# Altium schematic sheet pca10143_sheet7_wifi.SchDoc: PCA10143 - Wifi Device
size A3; Organization: Nordic Semiconductor; DocumentNumber: 6; Revision: 0.7.2; SheetNumber: 7; SheetTotal: 7; CompanyName: Nordic Semiconductor
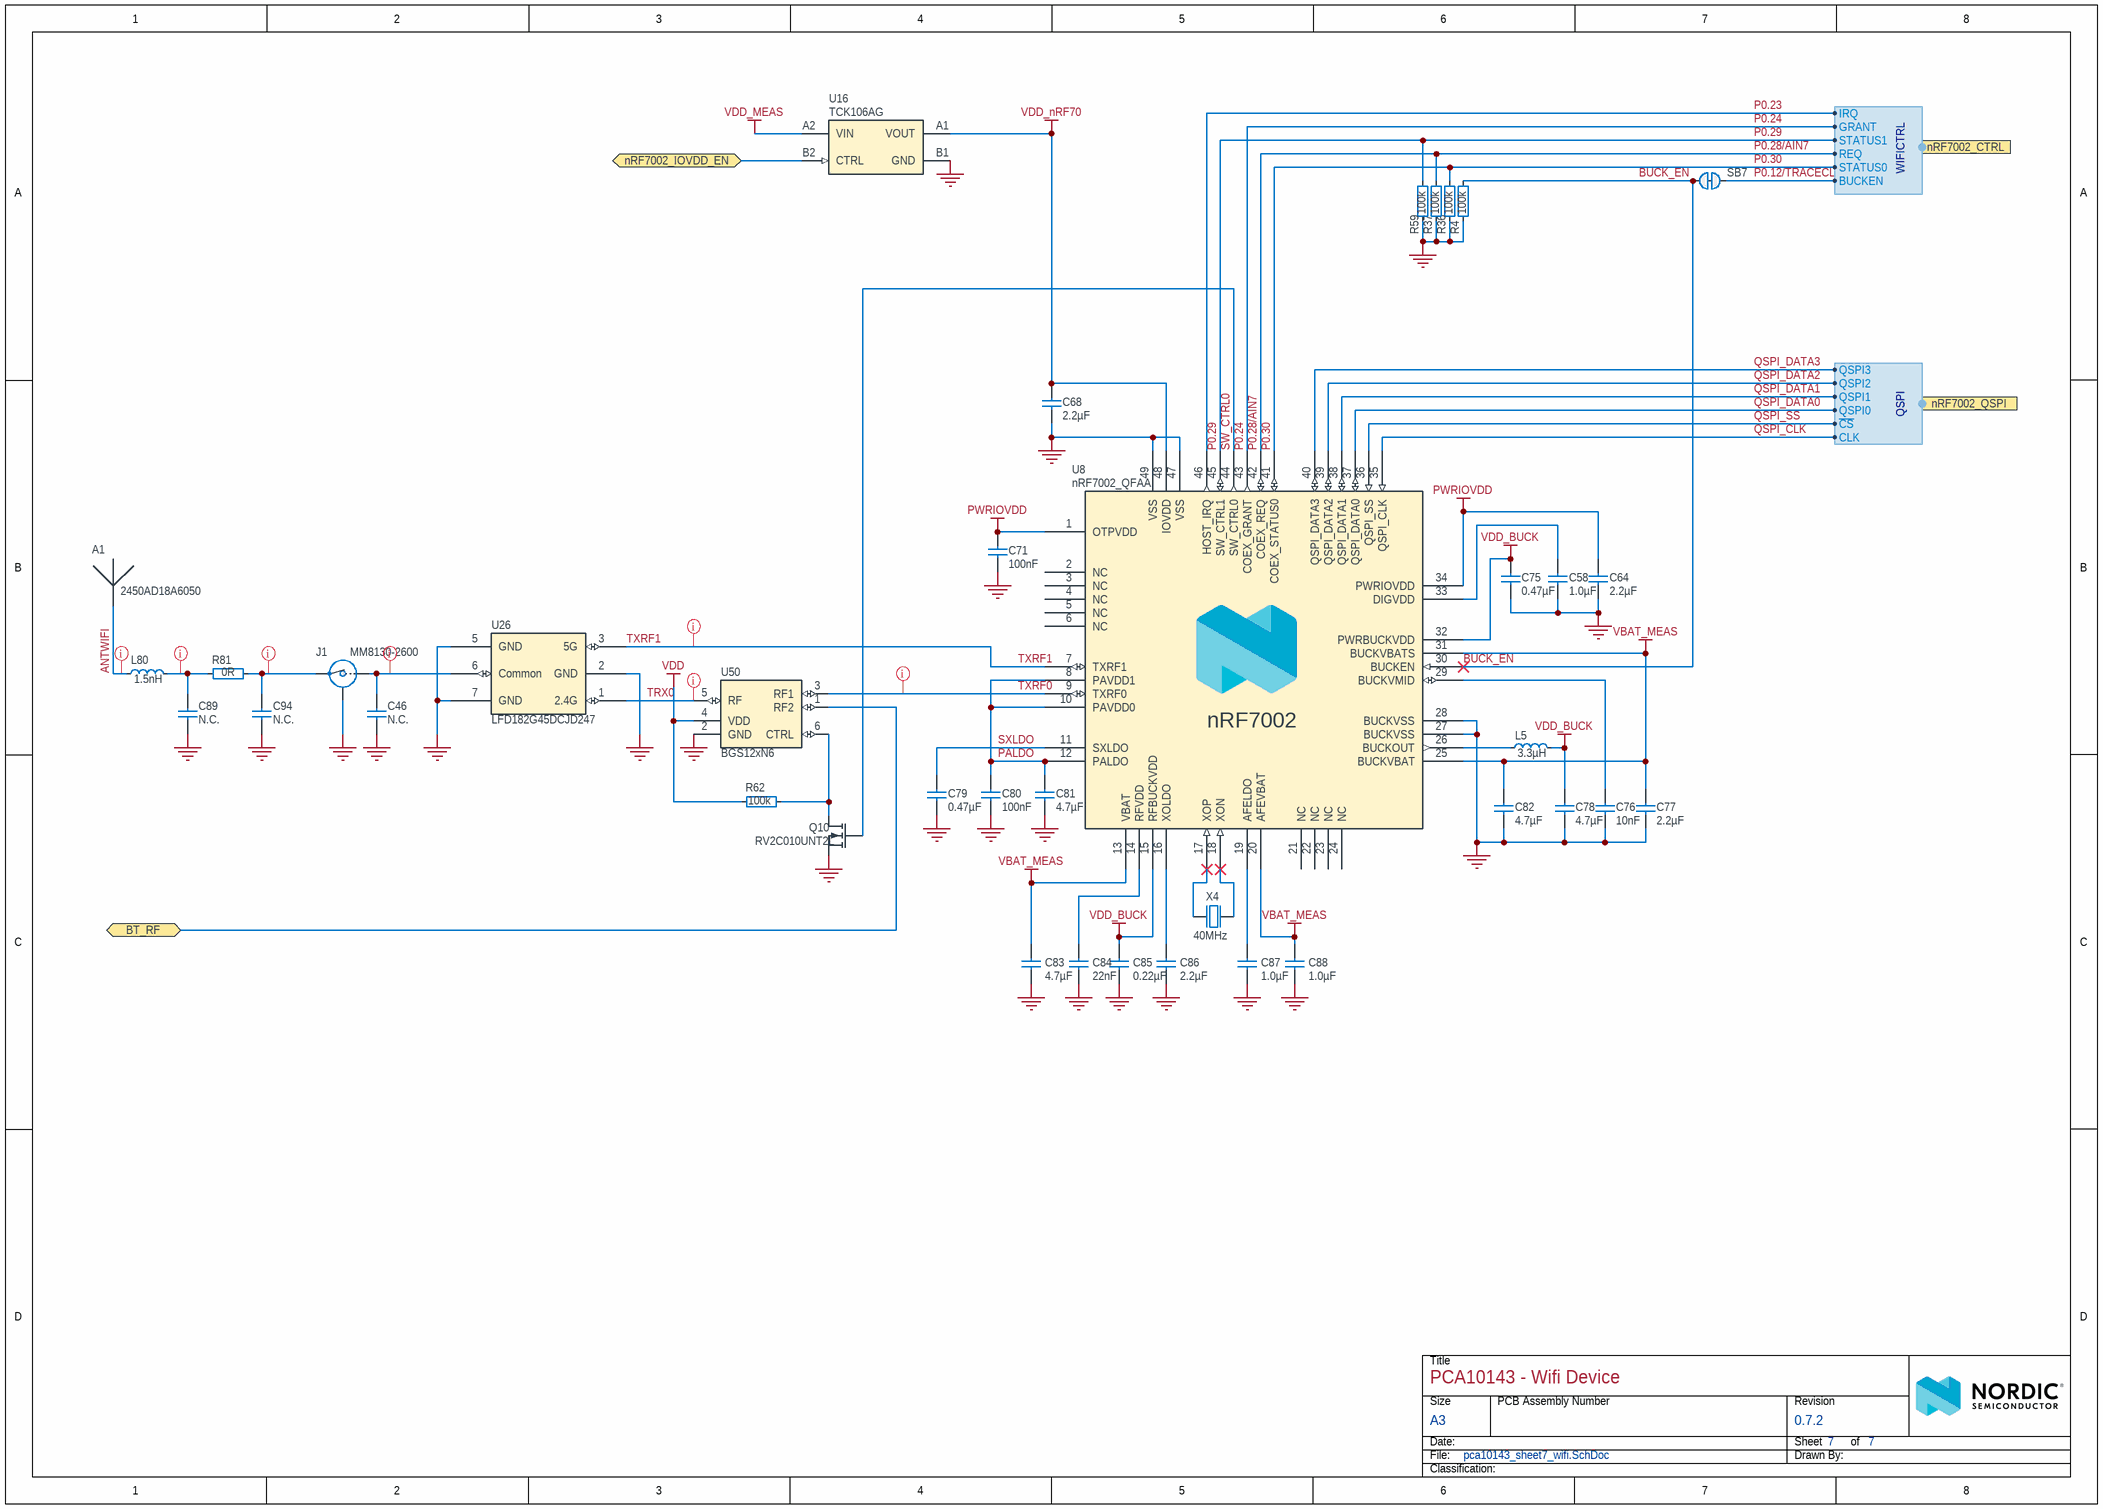
[diagram p0: pca10143_sheet7_wifi.SchDoc]

## Parts
A1  2450AD18A6050  [2450AD18A6050]
C46  N.C.  [CAPC0603X03L_C_NC]
C58  1.0µF  [CAPC1005X04L]
C64  2.2µF  [CAPC1005X04L]
C68  2.2µF  [CAPC1608X06L]
C71  100nF  [CAPC0603X03L_C]
C75  0.47µF  [CAPC0603X03L_C]
C76  10nF  [CAPC0603X03L_C]
C77  2.2µF  [CAPC1608X06L]
C78  4.7µF  [CAPC1608X06L]
C79  0.47µF  [CAPC0603X03L_C]
C80  100nF  [CAPC0603X03L_C]
C81  4.7µF  [CAPC1608X06L]
C82  4.7µF  [CAPC1608X06L]
C83  4.7µF  [CAPC1608X06L]
C84  22nF  [CAPC0603X03L_C]
C85  0.22µF  [CAPC0603X03L_C]
C86  2.2µF  [CAPC0603X03L_C]
C87  1.0µF  [CAPC1005X04L]
C88  1.0µF  [CAPC1005X04L]
C89  N.C.  [CAPC0603X03L_C_NC]
C94  N.C.  [CAPC0603X03L_C_NC]
J1  MM8130-2600  [COAXIAL-SWF]
L5  3.3µH  [INDC2520X10N]
L80  1.5nH  [INDC0603X03L_C]
Q10  RV2C010UNT2L  [DFN65P100X40-3L]
R4  100k  [RESC0603X03L_C]
R36  100k  [RESC0603X03L_C]
R37  100k  [RESC0603X03L_C]
R59  100k  [RESC0603X03L_C]
R62  100k  [RESC0603X03L_C]
R81  0R  [RESC0603X03L_C]
SB7  Solderbridge  [Solderbridge_Shorted]  (value not drawn)  (net tie, no BOM)
U8  nRF7002_QFAA  [QFN40P600X600X60-48N]
U16  TCK106AG  [BGA4C40P2X2_76X76X62]
U26  value LFD182G45DCJD247  [CAF-50P160X80-6N]  (hidden comment: LFD_Diplexer)
U50  BGS12xN6  [TSNP-6-8]
X4  40MHz  [BT-XTAL_1612]

## Ports
BT_RF (bidir), nRF7002_CTRL (harness WIFICTRL), nRF7002_IOVDD_EN (bidir), nRF7002_QSPI (harness QSPI)

## Harnesses
QSPI: ~{CS}, QSPI0, CLK, QSPI1, QSPI2, QSPI3
WIFICTRL: REQ, STATUS0, GRANT, IRQ, BUCKEN, STATUS1

## Nets
GND: C46.2 C58.2 C64.1 C68.2 C71.2 C75.1 C76.2 C77.2 C78.1 C79.1 C80.2 C81.1 C82.1 C83.1 C84.1 C85.1 C86.1 C87.1 C88.1 C89.2 C94.2 J1.2(Shield) Q10.2(S) R4.1 R36.2 R37.2 R59.2 U8.27(BUCKVSS) U8.28(BUCKVSS) U8.47(VSS) U8.49(VSS) U16.B1(GND) U26.2(GND) U26.5(GND) U26.7(GND) U50.2(GND) X4.2(GND) X4.4(GND)
PWRIOVDD: C64.2 C71.1 U8.1(OTPVDD) U8.34(PWRIOVDD)
VBAT_MEAS: C77.1 C82.2 C83.2 C88.2 U8.13(VBAT) U8.20(AFEVBAT) U8.25(BUCKVBAT) U8.31(BUCKVBATS)
VDD: R62.1 U50.4(VDD)
VDD_BUCK: C75.2 C78.2 C85.2 L5.2 U8.15(RFBUCKVDD) U8.32(PWRBUCKVDD)
VDD_MEAS: U16.A2(VIN)
VDD_nRF70: C68.1 U8.48(IOVDD) U16.A1(VOUT)
ANTWIFI: A1.1 L80.1
BT_RF: U50.1(RF2) ; port BT_RF
BUCK_EN: R4.2 SB7.2 U8.30(BUCKEN)
nRF7002_IOVDD_EN: U16.B2(CTRL) ; port nRF7002_IOVDD_EN
P0.12/TRACECLK: SB7.1 ; port nRF7002_CTRL.BUCKEN
P0.23: U8.46(HOST_IRQ) ; port nRF7002_CTRL.IRQ
P0.24: U8.43(COEX_GRANT) ; port nRF7002_CTRL.GRANT
P0.28/AIN7: R37.1 U8.42(COEX_REQ) ; port nRF7002_CTRL.REQ
P0.29: R59.1 U8.45(SW_CTRL1) ; port nRF7002_CTRL.STATUS1
P0.30: R36.1 U8.41(COEX_STATUS0) ; port nRF7002_CTRL.STATUS0
PALDO: C80.1 C81.2 U8.8(PAVDD1) U8.10(PAVDD0) U8.12(PALDO)
QSPI_CLK: U8.35(QSPI_CLK) ; port nRF7002_QSPI.CLK
QSPI_DATA0: U8.37(QSPI_DATA0) ; port nRF7002_QSPI.QSPI0
QSPI_DATA1: U8.38(QSPI_DATA1) ; port nRF7002_QSPI.QSPI1
QSPI_DATA2: U8.39(QSPI_DATA2) ; port nRF7002_QSPI.QSPI2
QSPI_DATA3: U8.40(QSPI_DATA3) ; port nRF7002_QSPI.QSPI3
QSPI_SS: U8.36(QSPI_SS) ; port nRF7002_QSPI.~{CS}
SW_CTRL0: Q10.1(G) U8.44(SW_CTRL0)
SXLDO: C79.2 U8.11(SXLDO)
TRX0: U26.1(2.4G) U50.5(RF)
TXRF0: U8.9(TXRF0) U50.3(RF1)
TXRF1: U8.7(TXRF1) U26.3(5G)
NetC46_1: C46.1 J1.1(IN) U26.6(Common)
NetC58_1: C58.1 U8.33(DIGVDD)
NetC76_1: C76.1 U8.29(BUCKVMID)
NetC84_2: C84.2 U8.14(RFVDD)
NetC86_2: C86.2 U8.16(XOLDO)
NetC87_2: C87.2 U8.19(AFELDO)
NetC89_1: C89.1 L80.2 R81.1
NetC94_1: C94.1 J1.3(OUT) R81.2
NetL5_1: L5.1 U8.26(BUCKOUT)
NetQ10_3: Q10.3(D) R62.2 U50.6(CTRL)
NetU8_17: U8.17(XOP) X4.1(inp)
NetU8_18: U8.18(XON) X4.3(out)

Not connected (* = marked no-connect by the designer): U8 2(NC) 3(NC) 4(NC) 5(NC) 6(NC) 21(NC) 22(NC) 23(NC) 24(NC); U50 8(NC)

## Layout directives
net class RF50Ohm: ANTWIFI, NetC46_1, NetC89_1, NetC94_1, TRX0, TXRF0, TXRF1

## Notes on the sheet
- Title
- Size
- Date:
- File:
- A3
- PCB Assembly Number
- Sheet         of
- Drawn By:
- Revision
- Classification:

## Library data of the parts
A1 = 2450AD18A6050: 2.4, 5, and 6GHz BT/WiFi6E Mini Antenna, Single-feed, Tri-band, Corner Mount; Manufacturer: Johanson Technology; Part number NEMS: 100700074; Pad Count: 2; Note: N.A.; Component Status: Active; Part Number: 2450AD18A6050; PartId: 100700074; Component Class: Antennas; Author: hany; Manufacturer Part Number: 2450AD18A6050; ComponentLink1URL: https://www.johansontechnology.com/datasheets/2450AD18A6050/2450AD18A6050.pdf; ComponentLink1Description: Datasheet; ComponentLink2URL: N.A.; ComponentLink2Description: Supplier link; HelpURL: N.A.; Footprint Doc: 2450AD18A6050; LatestRevisionDate: 2022-01-21; Published: 2022-01-21; Value: 2450AD18A6050; Supplier 1: Digi-Key; Supplier Part Number 1: 712-2450AD18A6050ETR-ND; Supplier 2: Mouser; Supplier Part Number 2: 609-2450AD18A6050; Artikkelnr Noca: N.A.; Part number IPS: N.A.; Part number Norautron: N.A.
C46 C89 C94 = C0201-N.C.: Not mounted; Manufacturer: N.A.; Part number NEMS: 100200001; Note: Chip Cap; Assembly: Not mounted; Pad Count: 2; Component Status: Active; Part Number: C0201-N.C.; Manufacturer Part Number: N.A.; LatestRevisionDate: 2014-11-13; Published: 2014-11-13; Value: N.C.; Artikkelnr Noca: N.A.; Footprint Doc: 0201; Part number IPS: N.A.; ComponentLink1URL: N.A.; ComponentLink1Description: Datasheet; ComponentLink2URL: N.A.; ComponentLink2Description: Supplier link; HelpURL: N.A.; Supplier 1: N.A.; Supplier Part Number 1: N.A.; Supplier 2: N.A.; Supplier Part Number 2: N.A.; Component Class: Capacitors; PartId: 100200001; Author: rsk; Part number Norautron: N.A.
C58 = C0402-1µ0-16V-X6S-GRM155C81C105KE11: Capacitor, Ceramic, 1.0µF 16V X6S 0402,±10%; Manufacturer: Murata; Part number NEMS: 100200493; Pad Count: 2; Artikkelnr Noca: N.A.; Component Status: Active; Part Number: C0402-1µ0-16V-X6S-GRM155C81C105KE11; Component Class: Capacitors; Author: prbu; Manufacturer Part Number: GRM155C81C105KE11; ComponentLink1URL: https://www.murata.com/en-sg/products/productdetail?partno=GRM155C81C105KE11%23; ComponentLink1Description: Datasheet; ComponentLink2URL: https://www.mouser.com/ProductDetail/Murata-Electronics/GRM155C81C105KE11J?qs=qSfuJ%252Bfl%2Fd5QDM5fFpbyoA%3D%3D; ComponentLink2Description: Supplier link; HelpURL: N.A.; Footprint Doc: 0402; LatestRevisionDate: 2021-12-09; Published: 2021-12-09; Value: 1.0µF; Note: 16V; Supplier 1: Mouser; Supplier Part Number 1: 81-GRM155C81C105KE1J; Supplier 2: Digi-Key; Supplier Part Number 2: 490-GRM155C81C105KE11JCT-ND; Part number IPS: N.A.; Part number Norautron: N.A.; PartId: 100200493
C64 = C0402-2µ2-25V-X5R-GRM155R61E225KE11: Capacitor, Ceramic, 2.2µF 25V X5R 0201,±10%; Manufacturer: Murata; Part number NEMS: 100200492; Pad Count: 2; Artikkelnr Noca: N.A.; Component Status: Active; Part Number: C0402-2µ2-25V-X5R-GRM155R61E225KE11; Component Class: Capacitors; Author: prbu; Manufacturer Part Number: GRM155R61E225KE11; ComponentLink1URL: https://www.murata.com/en-sg/products/productdetail?partno=GRM155R61E225KE11%23; ComponentLink1Description: Datasheet; ComponentLink2URL: https://www.mouser.com/ProductDetail/Murata-Electronics/GRM155R61E225KE11D?qs=eeBpzGFlv%252B8X58bIUndZvA%3D%3D; ComponentLink2Description: Supplier link; HelpURL: N.A.; Footprint Doc: 0402; LatestRevisionDate: 2021-12-09; Published: 2021-12-09; Value: 2.2µF; Note: 25V; Supplier 1: Mouser; Supplier Part Number 1: 81-GRM155R61E225KE1D; Supplier 2: Digi-Key; Supplier Part Number 2: 490-12703-1-ND; Part number IPS: N.A.; Part number Norautron: N.A.; PartId: 100200492
C68 C77 = C0603-2µ2-16V-X7S-GRM188C71C225KE11: Capacitor, Ceramic, 2.2µF 16V X7S 0603,±10%; Manufacturer: Murata; Part number NEMS: 100200490; Pad Count: 2; Artikkelnr Noca: N.A.; Component Status: Active; Part Number: C0603-2µ2-16V-X7S-GRM188C71C225KE11; Component Class: Capacitors; Author: prbu; Manufacturer Part Number: GRM188C71C225KE11; ComponentLink1URL: https://www.murata.com/en-sg/products/productdetail?partno=GRM188C71C225KE11%23; ComponentLink1Description: Datasheet; ComponentLink2URL: https://www.mouser.com/ProductDetail/Murata-Electronics/GRM188C71C225KE11D?qs=ipkqEa07%2FjwigLKmkO4MzA%3D%3D; ComponentLink2Description: Supplier link; HelpURL: N.A.; Footprint Doc: 0603; LatestRevisionDate: 2021-12-09; Published: 2021-12-09; Value: 2.2µF; Note: 16V; Supplier 1: Mouser; Supplier Part Number 1: 81-GRM188C71C225KE1D; Supplier 2: Digi-Key; Supplier Part Number 2: 490-12731-1-ND; Part number IPS: N.A.; Part number Norautron: N.A.; PartId: 100200490
C71 C80 = C0201-100n-16V-X7S-GRM033C71C104KE14: Capacitor, Ceramic, 100nF 16V X7S 0201,±10%; Manufacturer: Murata; Part number NEMS: 100200494; Pad Count: 2; Artikkelnr Noca: N.A.; Component Status: Active; Part Number: C0201-100n-16V-X7S-GRM033C71C104KE14; Component Class: Capacitors; Author: prbu; Manufacturer Part Number: GRM033C71C104KE14; ComponentLink1URL: https://www.murata.com/en-sg/products/productdetail?partno=GRM033C71C104KE14%23; ComponentLink1Description: Datasheet; ComponentLink2URL: https://www.mouser.com/ProductDetail/Murata-Electronics/GRM033C71C104KE14D?qs=P%2FC4Eoq9CDzkjc0H6wJP9A%3D%3D; ComponentLink2Description: Supplier link; HelpURL: N.A.; Footprint Doc: 0201; LatestRevisionDate: 2021-12-09; Published: 2021-12-09; Value: 100nF; Note: 16V; Supplier 1: Mouser; Supplier Part Number 1: 81-GRM33C71C104KE14D; Supplier 2: Digi-Key; Supplier Part Number 2: 490-10387-1-ND; Part number IPS: N.A.; Part number Norautron: N.A.; PartId: 100200494
C75 C79 = C0201-470n-6.3V-X5R-GRM033R60J474KE90: Capacitor, Ceramic, 0.47µF 6.3V X5R 0201,±10%; Manufacturer: Murata; Part number NEMS: 100200488; Pad Count: 2; Artikkelnr Noca: N.A.; Component Status: Active; Part Number: C0201-470n-6.3V-X5R-GRM033R60J474KE90; Component Class: Capacitors; Author: prbu; Manufacturer Part Number: GRM033R60J474KE90; ComponentLink1URL: https://www.murata.com/en-sg/products/productdetail?partno=GRM033R60J474KE90%23; ComponentLink1Description: Datasheet; ComponentLink2URL: https://www.mouser.com/ProductDetail/Murata-Electronics/GRM033R60J474KE90D?qs=sGAEpiMZZMsKMBVpGK0sItoTn08PM719efpAd7qZWQ4%3D; ComponentLink2Description: Supplier link; HelpURL: N.A.; Footprint Doc: 0201; LatestRevisionDate: 2021-12-09; Published: 2021-12-09; Value: 0.47µF; Note: 6.3V; Supplier 1: Digi-Key; Supplier Part Number 1: 490-10410-1-ND; Supplier 2: Mouser; Supplier Part Number 2: 81-GRM33R60J474KE90D; Part number IPS: N.A.; Part number Norautron: N.A.; PartId: 100200488
C76 = C0201-10n-16V-X7R-GRM033R71C103KE14: Capacitor, Ceramic, 10nF 16V X7R 0201,±10%; Manufacturer: Murata; Part number NEMS: 100200491; Pad Count: 2; Artikkelnr Noca: N.A.; Component Status: Active; Part Number: C0201-10n-16V-X7R-GRM033R71C103KE14; Component Class: Capacitors; Author: prbu; Manufacturer Part Number: GRM033R71C103KE14; ComponentLink1URL: https://www.murata.com/en-sg/products/productdetail?partno=GRM033R71C103KE14%23; ComponentLink1Description: Datasheet; ComponentLink2URL: https://www.mouser.com/ProductDetail/Murata-Electronics/GRM033R71C103KE14D?qs=QzBtWTOodeUmwPFZnw4Ogg%3D%3D; ComponentLink2Description: Supplier link; HelpURL: N.A.; Footprint Doc: 0201; LatestRevisionDate: 2021-12-09; Published: 2021-12-09; Value: 10nF; Note: 16V; Supplier 1: Digi-Key; Supplier Part Number 1: 490-14453-1-ND; Supplier 2: Mouser; Supplier Part Number 2: 81-GRM033R71C103KE4D; Part number IPS: N.A.; Part number Norautron: N.A.; PartId: 100200491
C78 C81-C83 = C0603-4µ7-25V-X6S-GRM188C81E475KE11: Capacitor, Ceramic, 4.7µF 25V X6S 0603,±10%; Manufacturer: Murata; Part number NEMS: 100200486; Pad Count: 2; Artikkelnr Noca: N.A.; Component Status: Active; Part Number: C0603-4µ7-25V-X6S-GRM188C81E475KE11; Component Class: Capacitors; Author: prbu; Manufacturer Part Number: GRM188C81E475KE11; ComponentLink1URL: https://www.murata.com/en-global/products/productdetail?partno=GRM188C81E475KE11%23; ComponentLink1Description: Datasheet; ComponentLink2URL: https://www.digikey.com/en/products/detail/murata-electronics/GRM188C81E475KE11D/3900424; ComponentLink2Description: Supplier link; HelpURL: N.A.; Footprint Doc: 0603; LatestRevisionDate: 2021-12-09; Published: 2021-12-09; Value: 4.7µF; Note: 25V; Supplier 1: Digi-Key; Supplier Part Number 1: 490-7199-1-ND; Supplier 2: Mouser; Supplier Part Number 2: 81-GRM188C81E475KE1D; Part number IPS: N.A.; Part number Norautron: N.A.; PartId: 100200486
C84 = C0201-22n-10V-X5R-GRM033R61A223KE84: Capacitor, Ceramic, 22nF 10V X5R 0201,±10%; Manufacturer: Murata; Part number NEMS: 100200495; Pad Count: 2; Artikkelnr Noca: N.A.; Component Status: Active; Part Number: C0201-22n-10V-X5R-GRM033R61A223KE84; Component Class: Capacitors; Author: prbu; Manufacturer Part Number: GRM033R61A223KE84; ComponentLink1URL: https://www.murata.com/en-sg/products/productdetail?partno=GRM033R61A223KE84%23; ComponentLink1Description: Datasheet; ComponentLink2URL: https://www.mouser.com/ProductDetail/Murata-Electronics/GRM033R61A223KE84E?qs=BZBei1rCqCCPqziwOnRusw%3D%3D; ComponentLink2Description: Supplier link; HelpURL: N.A.; Footprint Doc: 0201; LatestRevisionDate: 2021-12-09; Published: 2021-12-09; Value: 22nF; Note: 10V; Supplier 1: Mouser; Supplier Part Number 1: 81-GRM033R61A223KE4E; Supplier 2: Digi-Key; Supplier Part Number 2: 490-13334-1-ND; Part number IPS: N.A.; Part number Norautron: N.A.; PartId: 100200495
C85 = C0201-220n-10V-X5R-GRM033R61A224KE90: Capacitor, Ceramic, 0.22µF 10V X5R 0201, ±10%; Manufacturer: Murata; Part number NEMS: 100200487; Pad Count: 2; Artikkelnr Noca: N.A.; Component Status: Active; Part Number: C0201-220n-10V-X5R-GRM033R61A224KE90; Component Class: Capacitors; Author: prbu; Manufacturer Part Number: GRM033R61A224KE90; ComponentLink1URL: https://www.murata.com/en-sg/products/productdetail?partno=GRM033R61A224KE90%23; ComponentLink1Description: Datasheet; ComponentLink2URL: https://www.mouser.com/ProductDetail/Murata-Electronics/GRM033R61A224KE90D?qs=sGAEpiMZZMtXHE36kCvv3zgoTDayw1zTTbet6g8ub%252Bg%3D; ComponentLink2Description: Supplier link; HelpURL: N.A.; Footprint Doc: 0201; LatestRevisionDate: 2021-12-09; Published: 2021-12-09; Value: 0.22µF; Note: 10V; Supplier 1: Mouser; Supplier Part Number 1: 81-GRM33R61A224KE90D; Supplier 2: Mouser; Supplier Part Number 2: 81-GRM033R61A224KE0J; Part number IPS: N.A.; Part number Norautron: N.A.; PartId: 100200487
C86 = C0201-2µ2-10V-X5R-GRM033R61A225KE47: Capacitor, Ceramic, 2.2µF 10V X5R 0201,±10%; Manufacturer: Murata; Part number NEMS: 100200496; Pad Count: 2; Artikkelnr Noca: N.A.; Component Status: Active; Part Number: C0201-2µ2-10V-X5R-GRM033R61A225KE47; Component Class: Capacitors; Author: prbu; Manufacturer Part Number: GRM033R61A225KE47; ComponentLink1URL: https://www.murata.com/en-sg/products/productdetail?partno=GRM033R61A225KE47%23; ComponentLink1Description: Datasheet; ComponentLink2URL: https://www.mouser.com/ProductDetail/Murata-Electronics/GRM033R61A225KE47D?qs=I53XXhTNm8tqgHaFsI1bug%3D%3D; ComponentLink2Description: Supplier link; HelpURL: N.A.; Footprint Doc: 0201; LatestRevisionDate: 2021-12-09; Published: 2021-12-09; Value: 2.2µF; Note: 10V; Supplier 1: Mouser; Supplier Part Number 1: 81-GRM033R61A225KE7D; Supplier 2: Digi-Key; Supplier Part Number 2: 490-GRM033R61A225KE47JCT-ND; Part number IPS: N.A.; Part number Norautron: N.A.; PartId: 100200496
C87 = C0402-1µ0-10V-X7S-GRM155C71A105KE11: Capacitor, Ceramic, 1.0µF 10V X7S 0402,±10%; Manufacturer: Murata; Part number NEMS: 100200497; Pad Count: 2; Artikkelnr Noca: N.A.; Component Status: Active; Part Number: C0402-1µ0-10V-X7S-GRM155C71A105KE11; Component Class: Capacitors; Author: prbu; Manufacturer Part Number: GRM155C71A105KE11; ComponentLink1URL: https://www.murata.com/en-sg/products/productdetail?partno=GRM155C71A105KE11%23; ComponentLink1Description: Datasheet; ComponentLink2URL: https://www.digikey.com/en/products/detail/murata-electronics/GRM155C71A105KE11D/6606086; ComponentLink2Description: Supplier link; HelpURL: N.A.; Footprint Doc: 0402; LatestRevisionDate: 2021-12-09; Published: 2021-12-09; Value: 1.0µF; Note: 10V; Supplier 1: Mouser; Supplier Part Number 1: 81-GRM155C71A105KE1J; Supplier 2: Digi-Key; Supplier Part Number 2: 490-14457-1-ND; Part number IPS: N.A.; Part number Norautron: N.A.; PartId: 100200497
C88 = C0402-1µ0-35V-X5R-GRM155R6YA105KE11: Capacitor, Ceramic, 1.0µF 35V X5R 0402,±10%; Manufacturer: Murata; Part number NEMS: 100200489; Pad Count: 2; Artikkelnr Noca: N.A.; Component Status: Active; Part Number: C0402-1µ0-35V-X5R-GRM155R6YA105KE11; Component Class: Capacitors; Author: prbu; Manufacturer Part Number: GRM155R6YA105KE11; ComponentLink1URL: https://www.murata.com/en-sg/products/productdetail?partno=GRM155R6YA105KE11%23; ComponentLink1Description: Datasheet; ComponentLink2URL: https://www.digikey.com/en/products/detail/murata-electronics/GRM155R6YA105KE11D/4905162; ComponentLink2Description: Supplier link; HelpURL: N.A.; Footprint Doc: 0402; LatestRevisionDate: 2021-12-09; Published: 2021-12-09; Value: 1.0µF; Note: 35V; Supplier 1: Mouser; Supplier Part Number 1: 81-GRM155R6YA105KE1D; Supplier 2: Digi-Key; Supplier Part Number 2: 490-10019-1-ND; Part number IPS: N.A.; Part number Norautron: N.A.; PartId: 100200489
J1 = MM8130-2600: Coaxial Connector with Switch; Manufacturer: Murata; Part number IPS: 00000009955; Part number Norautron: 26030338; Part number NEMS: 100500400; Note: N.A.; Artikkelnr Noca: 55029011; Pad Count: 3; Component Status: Active; Part Number: MM8130-2600; Manufacturer Part Number: MM8130-2600; LatestRevisionDate: 2014-04-24; Published: 2014-04-24; Value: MM8130-2600; Footprint Doc: COAXIAL-SWF; ComponentLink1URL: N.A.; ComponentLink1Description: Datasheet; ComponentLink2URL: N.A.; ComponentLink2Description: Supplier link; HelpURL: http://www.murata.com/products/catalog/pdf/o33e.pdf; Supplier 1: Digi-Key; Supplier Part Number 1: 490-4981-1-ND; Supplier 2: Mouser; Supplier Part Number 2: 81-MM8130-2600RA2; Component Class: Connectors; PartId: 100500400; Author: rsk
L5 = L1008-3µ3-LQM2HPN3R3MGCL: Inductor, 1A, ±20%, 200mOhm; Manufacturer: Murata; Part number NEMS: 100300406; Pad Count: 2; Note: -55°C ~ 125°C; Artikkelnr Noca: N.A.; Component Status: Active; Part Number: L1008-3µ3-LQM2HPN3R3MGCL; PartId: 100300406; Component Class: Inductors; Author: prbu; Manufacturer Part Number: LQM2HPN3R3MGCL; ComponentLink1URL: https://www.murata.com/en-sg/products/productdetail?partno=LQM2HPN3R3MGC%23; ComponentLink1Description: Datasheet; ComponentLink2URL: https://www.digikey.com/en/products/detail/murata-electronics/LQM2HPN3R3MGCL/4359129?s=N4IgTCBcDaIDIEUCyYASAFAcgZgEraQHEBhOEAXQF8g; ComponentLink2Description: Supplier link; HelpURL: https://www.murata.com/en-sg/products/productdetail?partno=LQM2HPN3R3MGC%23; Footprint Doc: 1008; LatestRevisionDate: 2022-01-20; Published: 2022-01-20; Value: 3.3µH; Supplier 1: Digi-Key; Supplier Part Number 1: 490-12070-1-ND; Supplier 2: N.A.; Supplier Part Number 2: N.A.; Part number IPS: N.A.; Part number Norautron: N.A.
L80 = L0201-1n5-HQ-Murata: Inductor, 1000mA, ±0.1ｎH, 50mOhm; Manufacturer: Murata; Manufacturer Part Number: LQP03HQ1N5B02; Part number NEMS: 100300202; Pad Count: 2; Note: -55°C ~ 125°C; Artikkelnr Noca: N.A.; Component Status: Active; Part Number: L0201-1n5-HQ-Murata; PartId: 100300202; Component Class: Inductors; Author: rsk; ComponentLink1URL: https://search.murata.co.jp/Ceramy/image/img/P02/JELF243C-0021.pdf; ComponentLink1Description: Datasheet; ComponentLink2URL: N.A.; ComponentLink2Description: Supplier link; HelpURL: https://psearch.en.murata.com/inductor/product/LQP03HQ1N5B02%23.html; Footprint Doc: 0201; LatestRevisionDate: 2018-10-23; Published: 2018-10-23; Value: 1.5nH; Supplier 1: Digi-Key; Supplier Part Number 1: 490-13881-1-ND; Supplier 2: N.A.; Supplier Part Number 2: N.A.; Part number IPS: N.A.; Part number Norautron: N.A.
Q10 = RV2C010UNT2L: N-Channel MOSFET, 20V, 1A, 470mOhm, 400mW; Manufacturer: Rohm Semiconductor; Part number IPS: 00000009976; Part number Norautron: 26320026; Part number NEMS: 101300132; Note: N.A.; Artikkelnr Noca: 35010020; Pad Count: 3; Component Status: Active; Part Number: RV2C010UNT2L; Manufacturer Part Number: RV2C010UNT2L; LatestRevisionDate: 2016-08-09; Published: 2016-08-09; Value: RV2C010UNT2L; Footprint Doc: DFN-3; ComponentLink1URL: N.A.; ComponentLink1Description: Datasheet; ComponentLink2URL: N.A.; ComponentLink2Description: Supplier link; HelpURL: http://rohmfs.rohm.com/en/products/databook/datasheet/discrete/transistor/mosfet/rv2c010unt2l-e.pdf; Supplier 1: Digi-Key; Supplier Part Number 1: RV2C010UNT2LCT-ND; Supplier 2: Mouser; Supplier Part Number 2: 755-RV2C010UNT2L; Component Class: Semiconductors; PartId: 101300132; Author: rsk
R4 R36 R37 R59 R62 = R0201-100k: Resistor, ±1%, 0.05W; Manufacturer: N.A.; Part number IPS: 00000001419; Part number Norautron: 26108487; Part number NEMS: 100100080; Note: Chip Res 1%; Pad Count: 2; Component Status: Active; Part Number: R0201-100k; Manufacturer Part Number: N.A.; ComponentLink1URL: N.A.; ComponentLink1Description: Datasheet; ComponentLink2URL: N.A.; ComponentLink2Description: Supplier link; HelpURL: N.A.; Footprint Doc: 0201; LatestRevisionDate: 2014-11-13; Published: 2014-11-13; Value: 100k; Artikkelnr Noca: N.A.; Supplier 1: N.A.; Supplier Part Number 1: N.A.; Supplier 2: N.A.; Supplier Part Number 2: N.A.; Component Class: Resistors; PartId: 100100080; Author: rsk
R81 = R0201-0R: Resistor, ±5%, 0.05W; Manufacturer: N.A.; Part number IPS: 00000003245; Part number NEMS: 100100001; Pad Count: 2; Note: Chip Res 5%; Component Status: Active; Part Number: R0201-0R; PartId: 100100001; Component Class: Resistors; Author: rsk; Manufacturer Part Number: N.A.; ComponentLink1URL: N.A.; ComponentLink1Description: Datasheet; ComponentLink2URL: N.A.; ComponentLink2Description: Supplier link; HelpURL: N.A.; Footprint Doc: 0201; LatestRevisionDate: 2017-11-09; Published: 2014-11-13; Value: 0R; Supplier 1: N.A.; Supplier Part Number 1: N.A.; Supplier 2: N.A.; Supplier Part Number 2: N.A.; Artikkelnr Noca: N.A.; Part number Norautron: N.A.
SB7 = Solderbridge Shorted: Shorted Solderbridge; Manufacturer: N.A.; Part number NEMS: 100500459; Pad Count: 2; Component Status: Active; Part Number: Solderbridge Shorted; Manufacturer Part Number: N.A.; Footprint Doc: Solderbridge_Shorted; LatestRevisionDate: 2012-08-07; Published: 2012-08-07; Value: Solderbridge; Note: N.A.; Artikkelnr Noca: N.A.; Part number IPS: N.A.; ComponentLink1URL: N.A.; ComponentLink1Description: Datasheet; ComponentLink2URL: N.A.; ComponentLink2Description: Supplier link; HelpURL: N.A.; Supplier 1: N.A.; Supplier Part Number 1: N.A.; Supplier 2: N.A.; Supplier Part Number 2: N.A.; Component Class: Connectors; PartId: 100500459; Author: rsk; Part number Norautron: N.A.
U8 = nRF7002-QFAABB: Wifi Dual Band Companion chip; Manufacturer: Nordic Semiconductor; Component Status: Active; Pad Count: 49; Note: N.A.; Part Number: nRF7002-QFAABB; Component Class: nRF_Devices; Author: hany; Manufacturer Part Number: nRF7002-QFAABB; ComponentLink1URL: N.A.; ComponentLink1Description: Datasheet; ComponentLink2URL: N.A.; ComponentLink2Description: Supplier link; HelpURL: N.A.; LatestRevisionDate: 2022-12-01; Published: 2022-12-01; Footprint Doc: QFN-48; Value: nRF7002; Supplier 1: Nordic Semiconductor; Supplier Part Number 1: nRF7002-QFAABB; Supplier 2: N.A.; Supplier Part Number 2: N.A.; Artikkelnr Noca: N.A.; Part number IPS: N.A.; Part number Norautron: N.A.
U16 = TCK106AG: 1.0 A Load Switch IC with Slew Rate Control Driver in Ultra Small Package; Manufacturer: Toshiba; Manufacturer Part Number: TCK106AG,LF; Part number IPS: 00000004390; Part number Norautron: 26500627; Part number NEMS: 101900575; Note: N.A.; Pad Count: 4; Component Status: Active; Part Number: TCK106AG; ComponentLink1URL: https://toshiba.semicon-storage.com/info/docget.jsp?did=30131&prodName=TCK106AG; ComponentLink1Description: Datasheet; ComponentLink2URL: N.A.; ComponentLink2Description: Supplier link; HelpURL: N.A.; Footprint Doc: WLCSP-4; LatestRevisionDate: 2019-03-01; Published: 2019-02-17; Value: TCK106AG; Supplier 1: Digi-Key; Supplier Part Number 1: TCK106AGLFTR-ND; Supplier 2: Mouser; Supplier Part Number 2: 757-TCK106AGLF; Artikkelnr Noca: N.A.; Component Class: Misc_ICs; PartId: 101900575; Author: rsk
U26 = LFD182G45DCJD247: Signal Conditioning 2.4GHz and 5GHz Diplexer; Manufacturer: Murata; Part number NEMS: 100800026; Pad Count: 6; Note: N.A.; Component Status: Active; Part Number: LFD182G45DCJD247; Component Class: Filters; Author: hany; Manufacturer Part Number: LFD182G45DCJD247; ComponentLink1URL: https://no.mouser.com/datasheet/2/281/1/LFD182G45DCJD247-2399435.pdf; ComponentLink1Description: Datasheet; ComponentLink2URL: N.A.; ComponentLink2Description: Supplier link; HelpURL: N.A.; Footprint Doc: CAF; LatestRevisionDate: 2021-10-06; Published: 2021-10-06; Supplier 1: Mouser; Supplier Part Number 1: 81-LFD182G45DCJD247; Supplier 2: N.A.; Supplier Part Number 2: N.A.; Artikkelnr Noca: N.A.; Part number IPS: N.A.; Part number Norautron: N.A.; PartId: 100800026
U50 = BGS12SN6: Wideband SPDT RF Switch, 50MHz-6GHz. Max 30dBm, 1.8-3.5V; Manufacturer: Infineon Technologies; Manufacturer Part Number: BGS12SN6E6327XTSA1; Part number NEMS: 101900686; Pad Count: 6; Note: N.A.; Component Status: Active; Part Number: BGS12SN6; Component Class: Misc_ICs; Author: hany; ComponentLink1URL: https://no.mouser.com/datasheet/2/196/Infineon-BGS12SN6-DS-v02_03-EN-1226027.pdf; ComponentLink1Description: Datasheet; ComponentLink2URL: N.A.; ComponentLink2Description: Supplier link; HelpURL: https://no.mouser.com/datasheet/2/196/Infineon-BGS12SN6-DS-v02_03-EN-1226027.pdf; Footprint Doc: TSNP-6-8; LatestRevisionDate: 2022-02-17; Published: 2022-02-17; Value: BGS12SN6; Supplier 1: Mouser; Supplier Part Number 1: 726-BGS12SN6E6327XTS; Supplier 2: N.A.; Supplier Part Number 2: N.A.; Artikkelnr Noca: N.A.; Part number IPS: N.A.; Part number Norautron: N.A.; PartId: 101900686
X4 = XTAL_SMD1612_40MHz_8pF_KDS: XTAL SMD 1612, 40MHz, Cl=8pF, Total Tol: ±10ppm, -30 - 85C; Manufacturer: KDS; Manufacturer Part Number: DSX1612_40MHz; Part number NEMS: 101600102; Pad Count: 4; Note: XTAL SMD 40.000MHz 8pF; Artikkelnr Noca: N.A.; Component Status: Active; Part Number: XTAL_SMD1612_40MHz_8pF_KDS; PartId: 101600102; Component Class: Oscillators; Author: hany; ComponentLink1URL: N.A.; ComponentLink1Description: Datasheet; ComponentLink2URL: N.A.; ComponentLink2Description: Supplier link; HelpURL: N.A.; Footprint Doc: XTAL_1612; LatestRevisionDate: 2022-11-15; Published: 2022-11-15; Value: 40MHz; Supplier 1: N.A.; Supplier Part Number 1: N.A.; Supplier 2: N.A.; Supplier Part Number 2: N.A.; Part number IPS: N.A.; Part number Norautron: N.A.